# EAGLE design TOFSensorBoard (EAGLE 9.0.0)
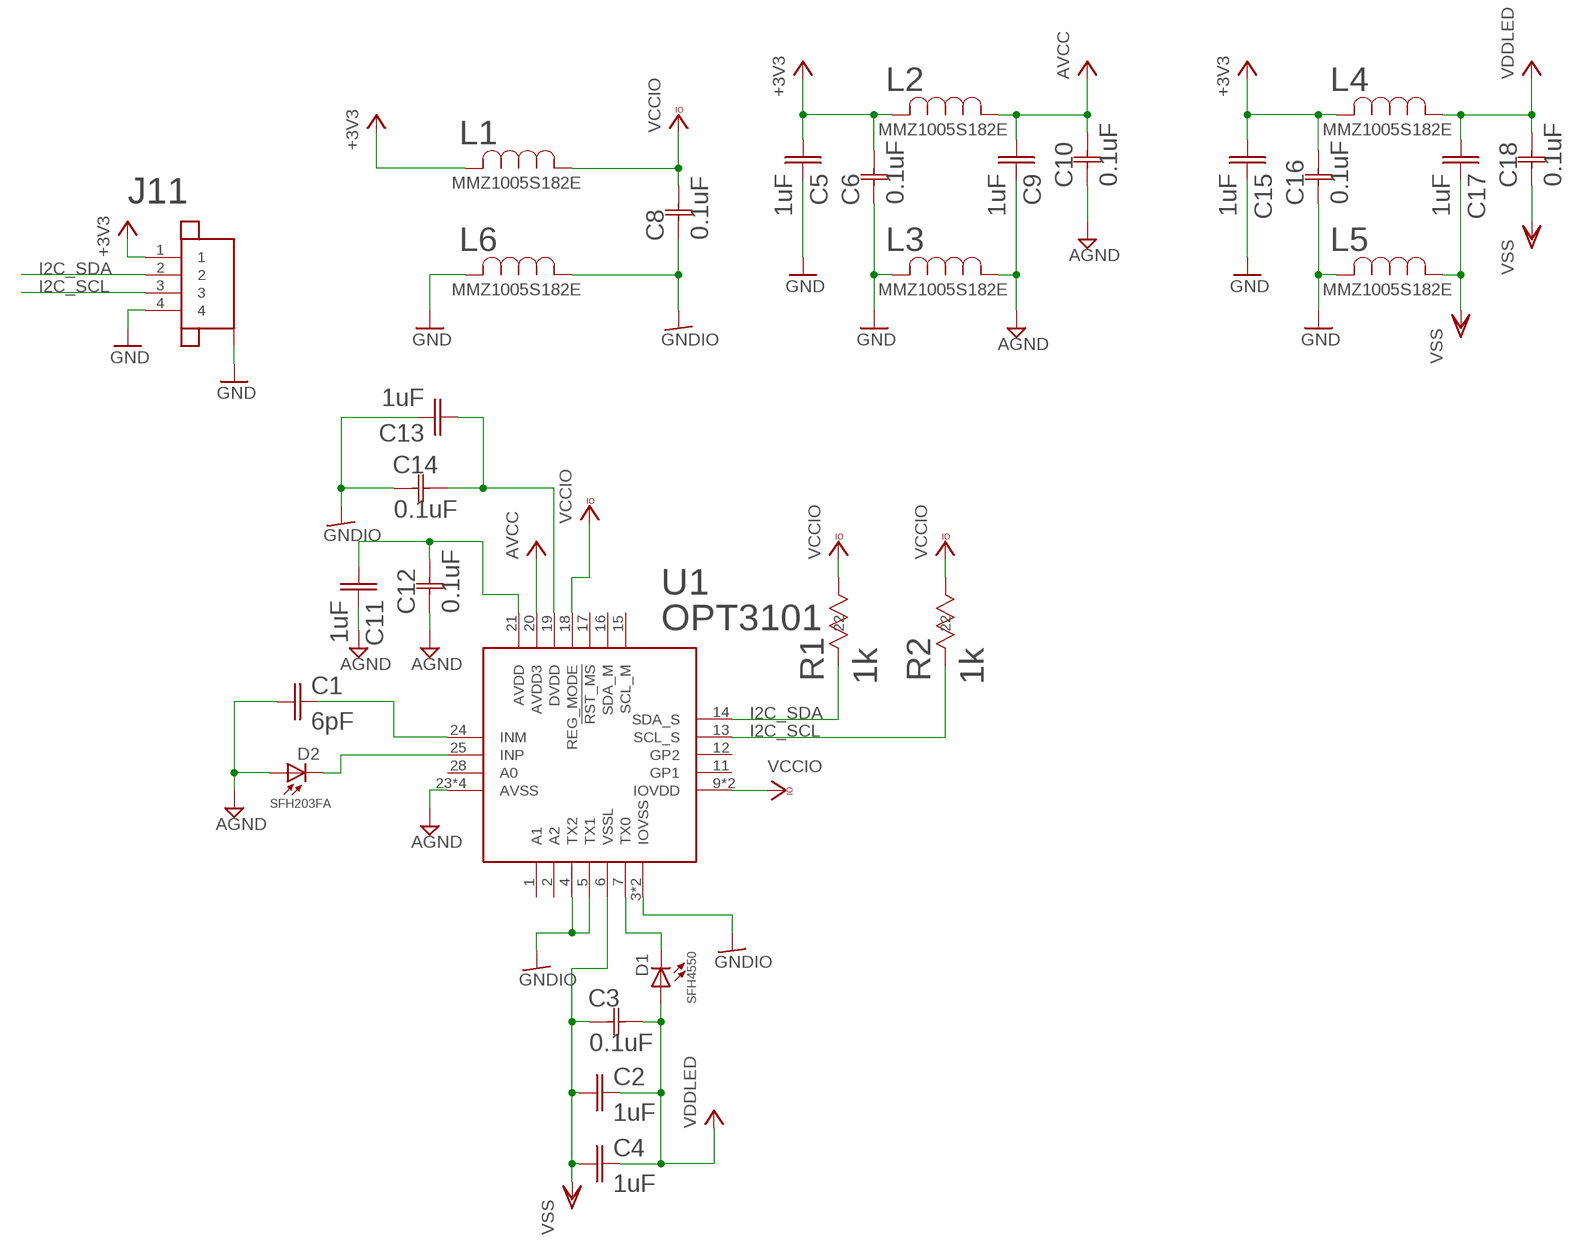
[diagram p0: schematic, sheet 1]

## Parts
C1  6pF  CL05C060DB5NCNC  [0402_CAPACITOR]
C2  1uF  CL10A105KP8NNNC  [0603_CAPACITOR]
C3  0.1uF  0402ZD104KAT2A0402-M  [0402-M]
C4  1uF  CL10A105KP8NNNC  [0603_CAPACITOR]
C5  1uF  CL10A105KP8NNNC  [0603_CAPACITOR]
C6  0.1uF  0402ZD104KAT2A0402-M  [0402-M]
C8  0.1uF  0402ZD104KAT2A0402-M  [0402-M]
C9  1uF  CL10A105KP8NNNC  [0603_CAPACITOR]
C10  0.1uF  0402ZD104KAT2A0402-M  [0402-M]
C11  1uF  CL10A105KP8NNNC  [0603_CAPACITOR]
C12  0.1uF  0402ZD104KAT2A0402-M  [0402-M]
C13  1uF  CL10A105KP8NNNC  [0603_CAPACITOR]
C14  0.1uF  0402ZD104KAT2A0402-M  [0402-M]
C15  1uF  CL10A105KP8NNNC  [0603_CAPACITOR]
C16  0.1uF  0402ZD104KAT2A0402-M  [0402-M]
C17  1uF  CL10A105KP8NNNC  [0603_CAPACITOR]
C18  0.1uF  0402ZD104KAT2A0402-M  [0402-M]
D1  SFH4550  [5MM_LED]
D2  SFH203FA  [5MM_LED]
J11  JST_SH_4POS  [JST_SH_4POS]
L1  MMZ1005S182ET000IND_1005-M  [IND_1005-M]
L2  MMZ1005S182ET000IND_1005-M  [IND_1005-M]
L3  MMZ1005S182ET000IND_1005-M  [IND_1005-M]
L4  MMZ1005S182ET000IND_1005-M  [IND_1005-M]
L5  MMZ1005S182ET000IND_1005-M  [IND_1005-M]
L6  MMZ1005S182ET000IND_1005-M  [IND_1005-M]
R1  1k  RC0603JR-071KLRC0603N-M  [RC0603N-M]
R2  1k  RC0603JR-071KLRC0603N-M  [RC0603N-M]
U1  OPT3101  [28-VQFN]

## Nets
+3V1: C13.1 C14.2 U1.19(DVDD)
+3V3: C5.1 C6.2 C15.1 C16.2 J11.1 L1.2 L2.2 L4.2
AGND: C1.1 C9.2 C10.1 C11.2 C12.1 D2.A L3.1 U1.23(AVSS) U1.26(AVSS) U1.27(AVSS) U1.29(AVSS)
AVCC: C9.1 C10.2 L2.1 U1.20(AVDD3)
GND: C5.2 C6.1 C15.2 C16.1 J11.4 J11.P$5 J11.P$6 L3.2 L5.2 L6.2
GNDIO: C8.1 C13.2 C14.1 L6.1 U1.3(IOVSS) U1.4(TX2) U1.5(TX1) U1.8(IOVSS)
I2C_SCL: J11.3 R2.2 U1.13(SCL_S)
I2C_SDA: J11.2 R1.2 U1.14(SDA_S)
N$2: C11.1 C12.2 U1.21(AVDD)
N$3: D1.C U1.7(TX0)
N$6: C1.2 U1.24(INM)
N$7: D2.C U1.25(INP)
VCCIO: C8.2 L1.1 R1.1 R2.1 U1.9(IOVDD) U1.10(IOVDD) U1.18(REG_MODE)
VDDLED: C2.2 C3.2 C4.2 C17.1 C18.2 D1.A L4.1
VSS: C2.1 C3.1 C4.1 C17.2 C18.1 L5.1 U1.6(VSSL)
Unconnected: U1.1(A1) U1.2(A2) U1.11(GP1) U1.12(GP2) U1.15(SCL_M) U1.16(SDA_M) U1.17(!RST_MS) U1.28(A0)

## Library data of the parts
C1 = thanics_robotics:CL05C060DB5NCNC
C2 C4 C5 C9 C11 C13 C15 C17 = thanics_robotics:CL10A105KP8NNNC
C3 C6 C8 C10 C12 C14 C16 C18 = 0.1uF-capacitor-0402:0402ZD104KAT2A; MANUFACTURER_PART_NUMBER: 0402ZD104KAT2A; VENDOR: AVX Corporation
D1 = thanics_robotics:SFH4550
D2 = thanics_robotics:SFH203FA
J11 = thanics_robotics:JST_SH_4POS
L1-L6 = 1.8k-fb:MMZ1005S182ET000; MANUFACTURER_PART_NUMBER: MMZ1005S182ET000; VENDOR: TDK
R1 R2 = 1k-resistor:RC0603JR-071KL; CASE: 0603 1608 metric; COMPOSITION: Thick Film; COPYRIGHT: Copyright C 2015 Accelerated Designs. All rights reserved; DATASHEET: httpwww.yageo.comdocumentsrecentPYuRC0603_51_RoHS_L_4.pdf; DESCRIPTION: RES 1.0K OHM 110W 5% 0603 SMD; DIGIKEYPARTNUMBER: 3111.0KGRTRND; HEIGHT: 0.022" 0.55mm; LEADSTYLE: Surface Mount SMD SMT; MANUFACTURER_PART_NUMBER: RC0603JR071KL; NEWARKPARTNUMBER: 14M7231; NUMBEROFTERMINATIONS: 2; PACKAGECASE: 0603 1608 Metric; PACKAGING: Tape &amp Reel TR; POWERWATTS: 0.1W 110W; QUANTITY_AVAILABLE: 0; RESISTANCEINOHMS: 1.00K; RESISTANCEOHMS: 1K; SIZEDIMENSION: 0.063" L x 0.031" W 1.60mm x 0.80mm; TEMPERATURECOEFFICIENT: 100ppm°C; TOLERANCE: 5%; VENDOR: Yageo; VOLTAGEWORKING: 50V
U1 = thanics_robotics:OPT3101

## Board
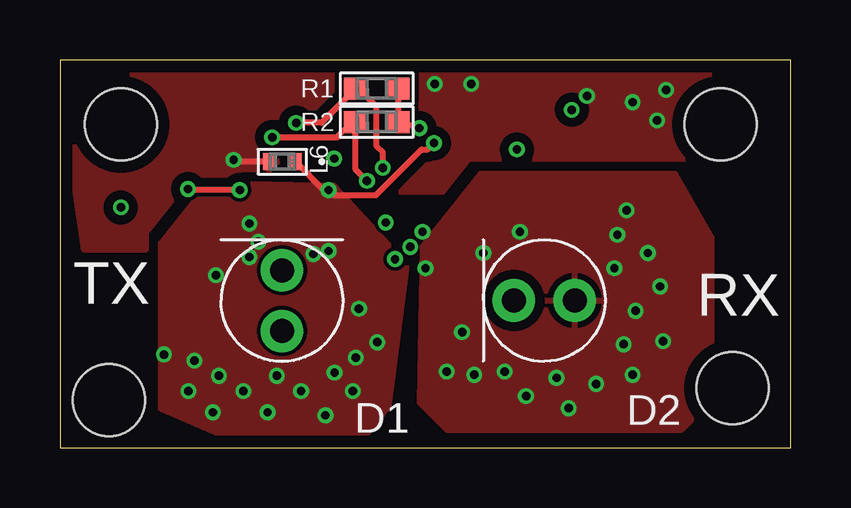
[diagram p1: board, top side]
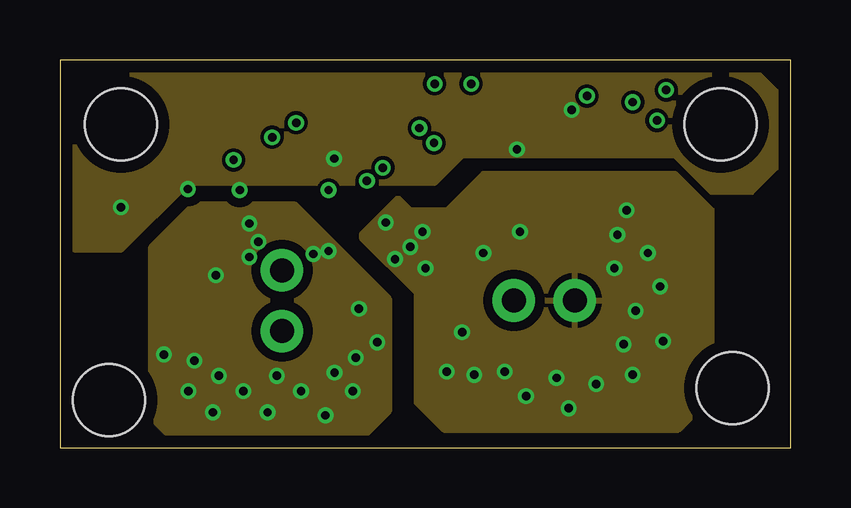
[diagram p2: board, inner layer Route2]
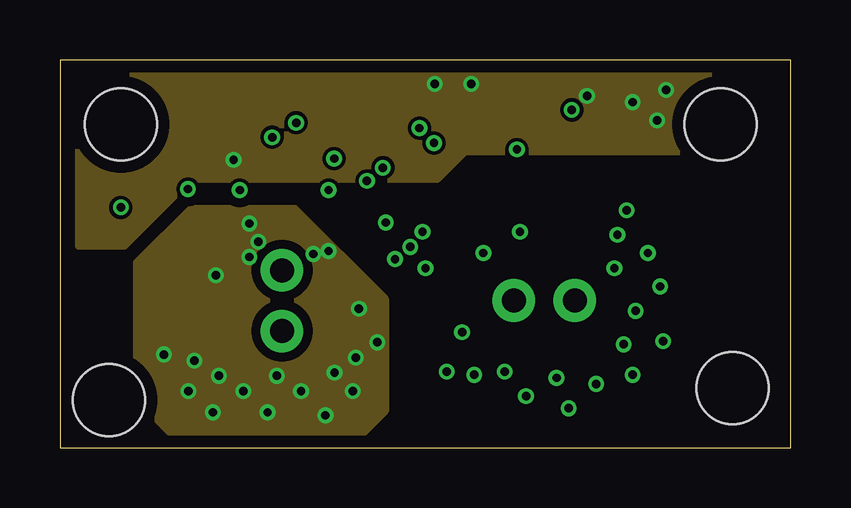
[diagram p3: board, inner layer Route15]
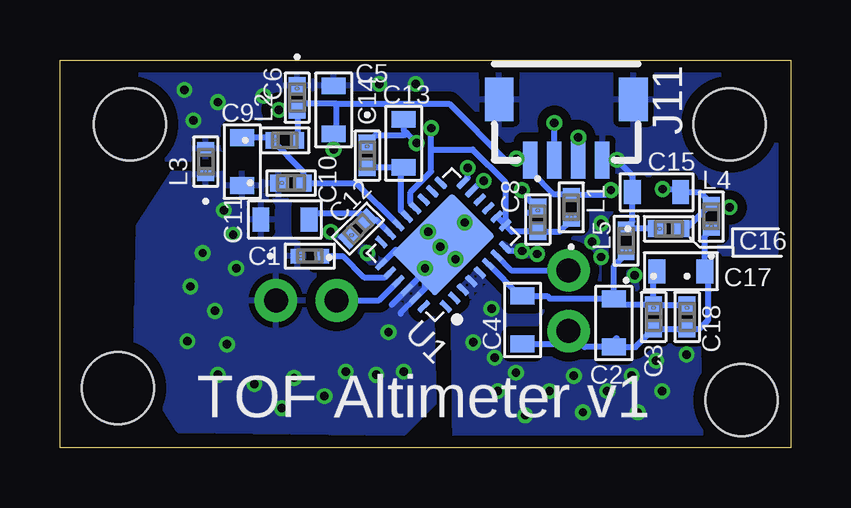
[diagram p4: board, bottom side, seen from below]

Size 30.46 x 16.18 mm. Coordinates in mm from the lower left corner, seen from the top.
Outline: 0,0 30.46,0 30.46,16.18 0,16.18 0,0
Copper layers (1*2*15*16): Top 0.035mm / dielectric 0.2mm / Route2 0.035mm / dielectric 1.2mm / Route15 0.035mm / dielectric 0.2mm / Bottom 0.035mm
Design rules "Elecrow_4-layer_PCB_eagle_rule": minimum track width 6mil, minimum drill 12mil, track to track 6mil, track to pad 6mil, pad to pad 6mil, via to via 8mil, smd to smd 0mil, copper to edge 20mil, drill to drill 10mil, minimum pad ring 6mil, minimum via ring 6mil, stop-mask expansion 0mil, vias tented up to drill 100mil, thermal gap 10mil
Holes 3 mm at 2.54,13.5 27.54,13.5 28.04,2.5 2.04,2

### Footprints (pad centres in the part's own frame; a part is rotated, then mirrored left to right if it is on the bottom)
0402_CAPACITOR = smd 0.559 x 0.61: 1 -0.521,0; 2 0.521,0
0603_CAPACITOR = smd 0.701 x 1.001: 1 -1.001,0; 2 1.001,0
0402-M = smd 0.711 x 0.711: 1 -0.508,0; 2 0.508,0
5MM_LED = drill 1 pad 1.778: A 1.27,0; C -1.27,0
JST_SH_4POS = smd 0.6 x 1.55: 1 -1.5,0; 2 -0.5,0; 3 0.5,0; 4 1.5,0 | smd 1.2 x 1.8: P$5 -2.8,2.525; P$6 2.8,2.525
IND_1005-M = smd 0.525 x 0.702: 1 -0.542,0; 2 0.542,0
RC0603N-M = smd 0.965 x 0.914: 1 -0.876,0; 2 0.876,0
28-VQFN = smd 0.6 x 0.24: 1 -1.9,1.75; 2 -1.9,1.25; 3 -1.9,0.75; 4 -1.9,0.25; 5 -1.9,-0.25; 6 -1.9,-0.75; 7 -1.9,-1.25; 8 -1.9,-1.75; 15 1.9,-1.75; 16 1.9,-1.25; 17 1.9,-0.75; 18 1.9,-0.25; 19 1.9,0.25; 20 1.9,0.75; 21 1.9,1.25; 22 1.9,1.75 | smd 0.24 x 0.6: 9 -1.25,-2.4; 10 -0.75,-2.4; 11 -0.25,-2.4; 12 0.25,-2.4; 13 0.75,-2.4; 14 1.25,-2.4; 23 1.25,2.4; 24 0.75,2.4; 25 0.25,2.4; 26 -0.25,2.4; 27 -0.75,2.4; 28 -1.25,2.4 | smd 2.55 x 3.55: 29 0,0

### Placement (x,y rotation side)
C1  20.04,8 0 bottom
C2  7.37,5.21 270 bottom
C3  5.71,5.46 270 bottom
C4  11.18,5.33 270 bottom
C5  19.05,14.1 90 bottom
C6  20.57,14.61 270 bottom
C8  10.54,9.53 270 bottom
C9  22.86,11.94 270 bottom
C10  20.83,11.05 0 bottom
C11  21.08,9.53 180 bottom
C12  18.03,9.14 45 bottom
C13  16.13,12.7 90 bottom
C14  17.65,12.19 270 bottom
C15  5.59,10.67 180 bottom
C16  5.08,9.14 0 bottom
C17  4.57,7.37 180 bottom
C18  4.32,5.46 270 bottom
D1  9.25,6.14 270 top
D2  20.19,6.15 0 top
J11  9.35,12.01 0 bottom
L1  9.14,10.03 90 bottom
L2  21.08,12.83 0 bottom
L3  24.38,11.94 90 bottom
L4  3.3,9.65 90 bottom
L5  6.86,8.64 90 bottom
L6  9.27,11.94 180 top
R1  13.21,14.99 180 top
R2  13.21,13.59 180 top
U1  14.48,8.48 135 bottom

### Tracks (layer width: path | path; a pad name or v marks a point on that pad's centre or on a via)
+3V1
  Bottom 0.254: U1.19 16.25,9.89 16.25,11.58 C13.1 16.14,11.68 C14.2
+3V3  (via drill 0.35)
  Top 0.254: v7.49,10.75 5.38,10.75 v5.33,10.79
  Bottom 0.254: 18.92,14.35 14.22,14.35 11.88,12.01 J11.1 10.79,11.95 10.79,11.48 9.89,10.57 L1.2 7.67,10.57 v7.49,10.75 | C16.2 4.35,9.14 L4.2 3.78,10.67 C15.1 4.71,10.79 v5.33,10.79 | C5.1 18.92,13.22 18.92,14.35 | 18.92,14.35 20.32,14.35 C6.2 20.54,14.06 L2.2
  other vias: 11.43,12.06 21.34,14.1 19.05,12.45 2.54,10.03
  pour Route2: 0.64,8.26 0.64,14.73 1.52,15.62 29.08,15.62 29.84,14.86 29.84,11.68 28.83,10.67 27.18,10.67 25.65,12.19 16.76,12.19 15.62,11.05 5.33,11.05 2.54,8.26
AGND  (via drill 0.35)
  Bottom 0.254: 15.24,7.36 U1.26 16.63,5.97 16.64,5.97 | 15.24,7.36 14.48,8.12 14.48,8.38 | 14.48,8.38 U1.29 | U1.23 16.47,8.26 14.61,8.26 14.48,8.38 | 16.26,5.59 16.26,5.64 U1.27 15.24,6.66 15.24,7.36
  other vias: 16.76,4.83 16.13,3.17 17.27,3.05 18.54,3.17 19.43,2.16 20.7,2.92 22.35,2.67 23.88,3.05 23.5,4.32 25.15,4.45 24,5.71 25.02,6.73 23.11,7.49 24.51,8.13 23.24,8.89 23.62,9.91 17.65,8.13 19.18,9.02 21.21,1.65 15.11,9.02 13.97,7.87 14.61,8.38 13.59,9.4 15.24,7.49
  pour Bottom (isolate 0.381): 17.53,11.43 25.78,11.43 27.18,9.27 27.3,3.56 25.53,0.76 16.13,0.64 14.86,1.91 14.99,7.24
  pour Top (isolate 0.381): 15.11,8.38 14.99,1.91 16.13,0.76 25.91,0.76 27.18,2.03 27.18,8.76 25.65,11.43 17.53,11.43
  pour Route2 (isolate 0.381): 25.65,11.43 17.65,11.43 16.13,9.91 14.61,9.91 14.1,10.41 12.57,8.89 12.57,8.76 14.86,6.48 14.86,1.91 16,0.76 25.78,0.76 27.18,2.16 27.18,9.27 27.18,9.91
AVCC
  Bottom 0.254: C9.1 21.74,12.94 L2.1 20.32,11.52 C10.2 18.11,11.05 U1.20
GND  (via drill 0.35)
  Top 0.254: L6.2 7.31,11.94 v7.24,12.01
  Bottom 0.254: 6.93,12.01 v7.24,12.01 | v7.24,12.01 J11.4 | C16.1 5.62,9.18 L5.2 6.59,9.45 C15.2 6.59,11.36 v7.24,12.01
  other vias: 25.27,14.93 21.97,14.68 23.88,14.42 24.89,13.66 17.14,15.18 15.62,15.18
  pour Top (isolate 0.381, rank 2): 30.35,11.81 29.21,10.67 14.22,10.67 6.1,11.18 3.56,8.26 1.02,8.26 0.25,13.46 2.67,15.88 30.23,15.88
  pour Bottom (isolate 0.381, rank 2): 29.97,11.68 28.83,10.54 13.84,10.54 5.71,11.05 3.17,8.13 0.64,8.13 -0.13,13.34 2.29,15.75 29.84,15.75
  pour Route15: 0.76,8.38 0.76,14.86 1.65,15.75 29.21,15.75 29.97,14.99 29.97,11.81 28.96,10.79 27.3,10.79 25.78,12.32 16.89,12.32 15.75,11.18 5.46,11.18 2.67,8.38
GNDIO  (via drill 0.35)
  Top 0.254: v15.59,12.71 15.32,12.45 15.08,12.45 13.16,10.53 11.42,10.53 v11.2,10.75 11,10.75 L6.1
  Bottom 0.254: 10.94,9.8 C8.1 10.79,10.22 v11.2,10.75 | C13.2 16.13,13.25 15.98,13.1 | 15.98,13.1 v15.59,12.71 | 15.98,13.1 16,13.08 16.12,13.05 17.3,13.05 C14.1 | v11.2,8.21 11.74,8.21 U1.8
  other vias: 10.56,8.09 12.47,5.8 8.27,8.59 7.89,7.96 13.23,4.4 12.34,3.77 12.21,2.37 11.45,3.13 10.05,2.37 9.04,3.01 7.64,2.37 6.62,3.01 5.61,3.64 5.35,2.37 4.34,3.9 6.5,7.2 7.89,9.36 8.66,1.48 6.37,1.48 11.07,1.36
  pour Bottom (isolate 0.381): 3.94,9.82 14.17,9.78 14.04,0 3.72,0.51
  pour Top: 12.83,0.64 13.72,1.78 14.48,7.62 11.43,10.92 6.22,11.05 4.19,8.51 4.19,1.65 6.86,0.51
  pour Route2 (isolate 0.381): 13.72,6.22 13.72,1.52 12.7,0.51 4.57,0.51 3.81,1.27 3.81,8.38 5.59,10.16 9.78,10.16
  pour Route15 (isolate 0.381): 13.59,6.22 13.59,1.52 12.57,0.51 4.7,0.51 3.17,2.03 3.17,7.75 5.46,10.03 9.78,10.03
I2C_SCL  (via drill 0.35)
  Top 0.254: v12.8,11.13 12.33,11.6 12.33,13.46 | 12.33,13.46 R2.2 | 12.33,13.46 12.2,13.6 11.56,12.95 v8.85,12.95
  Bottom 0.254: U1.13 12.88,11.13 v12.8,11.13 | J11.3 v8.85,12.95
I2C_SDA  (via drill 0.35)
  Top 0.254: v13.46,11.68 13.46,12.33 13.21,12.59 13.21,14.22 12.45,14.99 R1.2 10.91,13.56 v9.85,13.56
  Bottom 0.254: U1.14 13.46,11.26 v13.46,11.68 | J11.2 v9.85,13.56
N$2
  Bottom 0.254: U1.21 17.27,9.5 C12.2 17.95,9.78 19.83,9.78 C11.1
N$3
  Bottom 0.254: U1.7 11.64,7.41 D1.C
N$6
  Bottom 0.254: C1.2 18.67,8 17.78,7.11 16.9,7.11 U1.24
N$7
  Bottom 0.254: 18.92,6.29 D2.C 17.16,6.15 U1.25
VCCIO  (via drill 0.35)
  Top 0.254: v14.99,13.34 14.86,13.46 14.21,13.46 R2.1 R1.1
  Bottom 0.254: U1.10 U1.9 | 14.99,12.45 v14.99,13.34 | 14.99,12.45 13.25,12.45 11.9,11.09 U1.9 | U1.18 15.84,10.2 15.84,10.67 14.99,11.53 14.99,12.45 | L1.1 9.62,9.02 C8.2 11.62,9.02 U1.9
VDDLED
  Bottom 0.254: C2.2 7.37,4.46 7.25,4.57 | C4.2 9.79,4.33 D1.A 8.59,4.21 C2.2 | C2.2 6.46,4.21 C3.2 C18.2 3.81,4.95 3.43,5.33 3.43,7.48 C17.1 3.57,8.84 L4.1
VSS
  Bottom 0.254: C2.1 7.48,6.22 10.03,6.22 10.14,6.33 C4.1 11.28,6.33 U1.6 | C3.1 C18.1 | C3.1 7.13,5.97 C2.1 | C3.1 5.71,7.48 C17.2 | C2.1 7.37,7.59 L5.1

### Text on the board
tPlace: TX | RX
bPlace: TOF Altimeter v1